# EAGLE design owl digital (EAGLE 6.4)
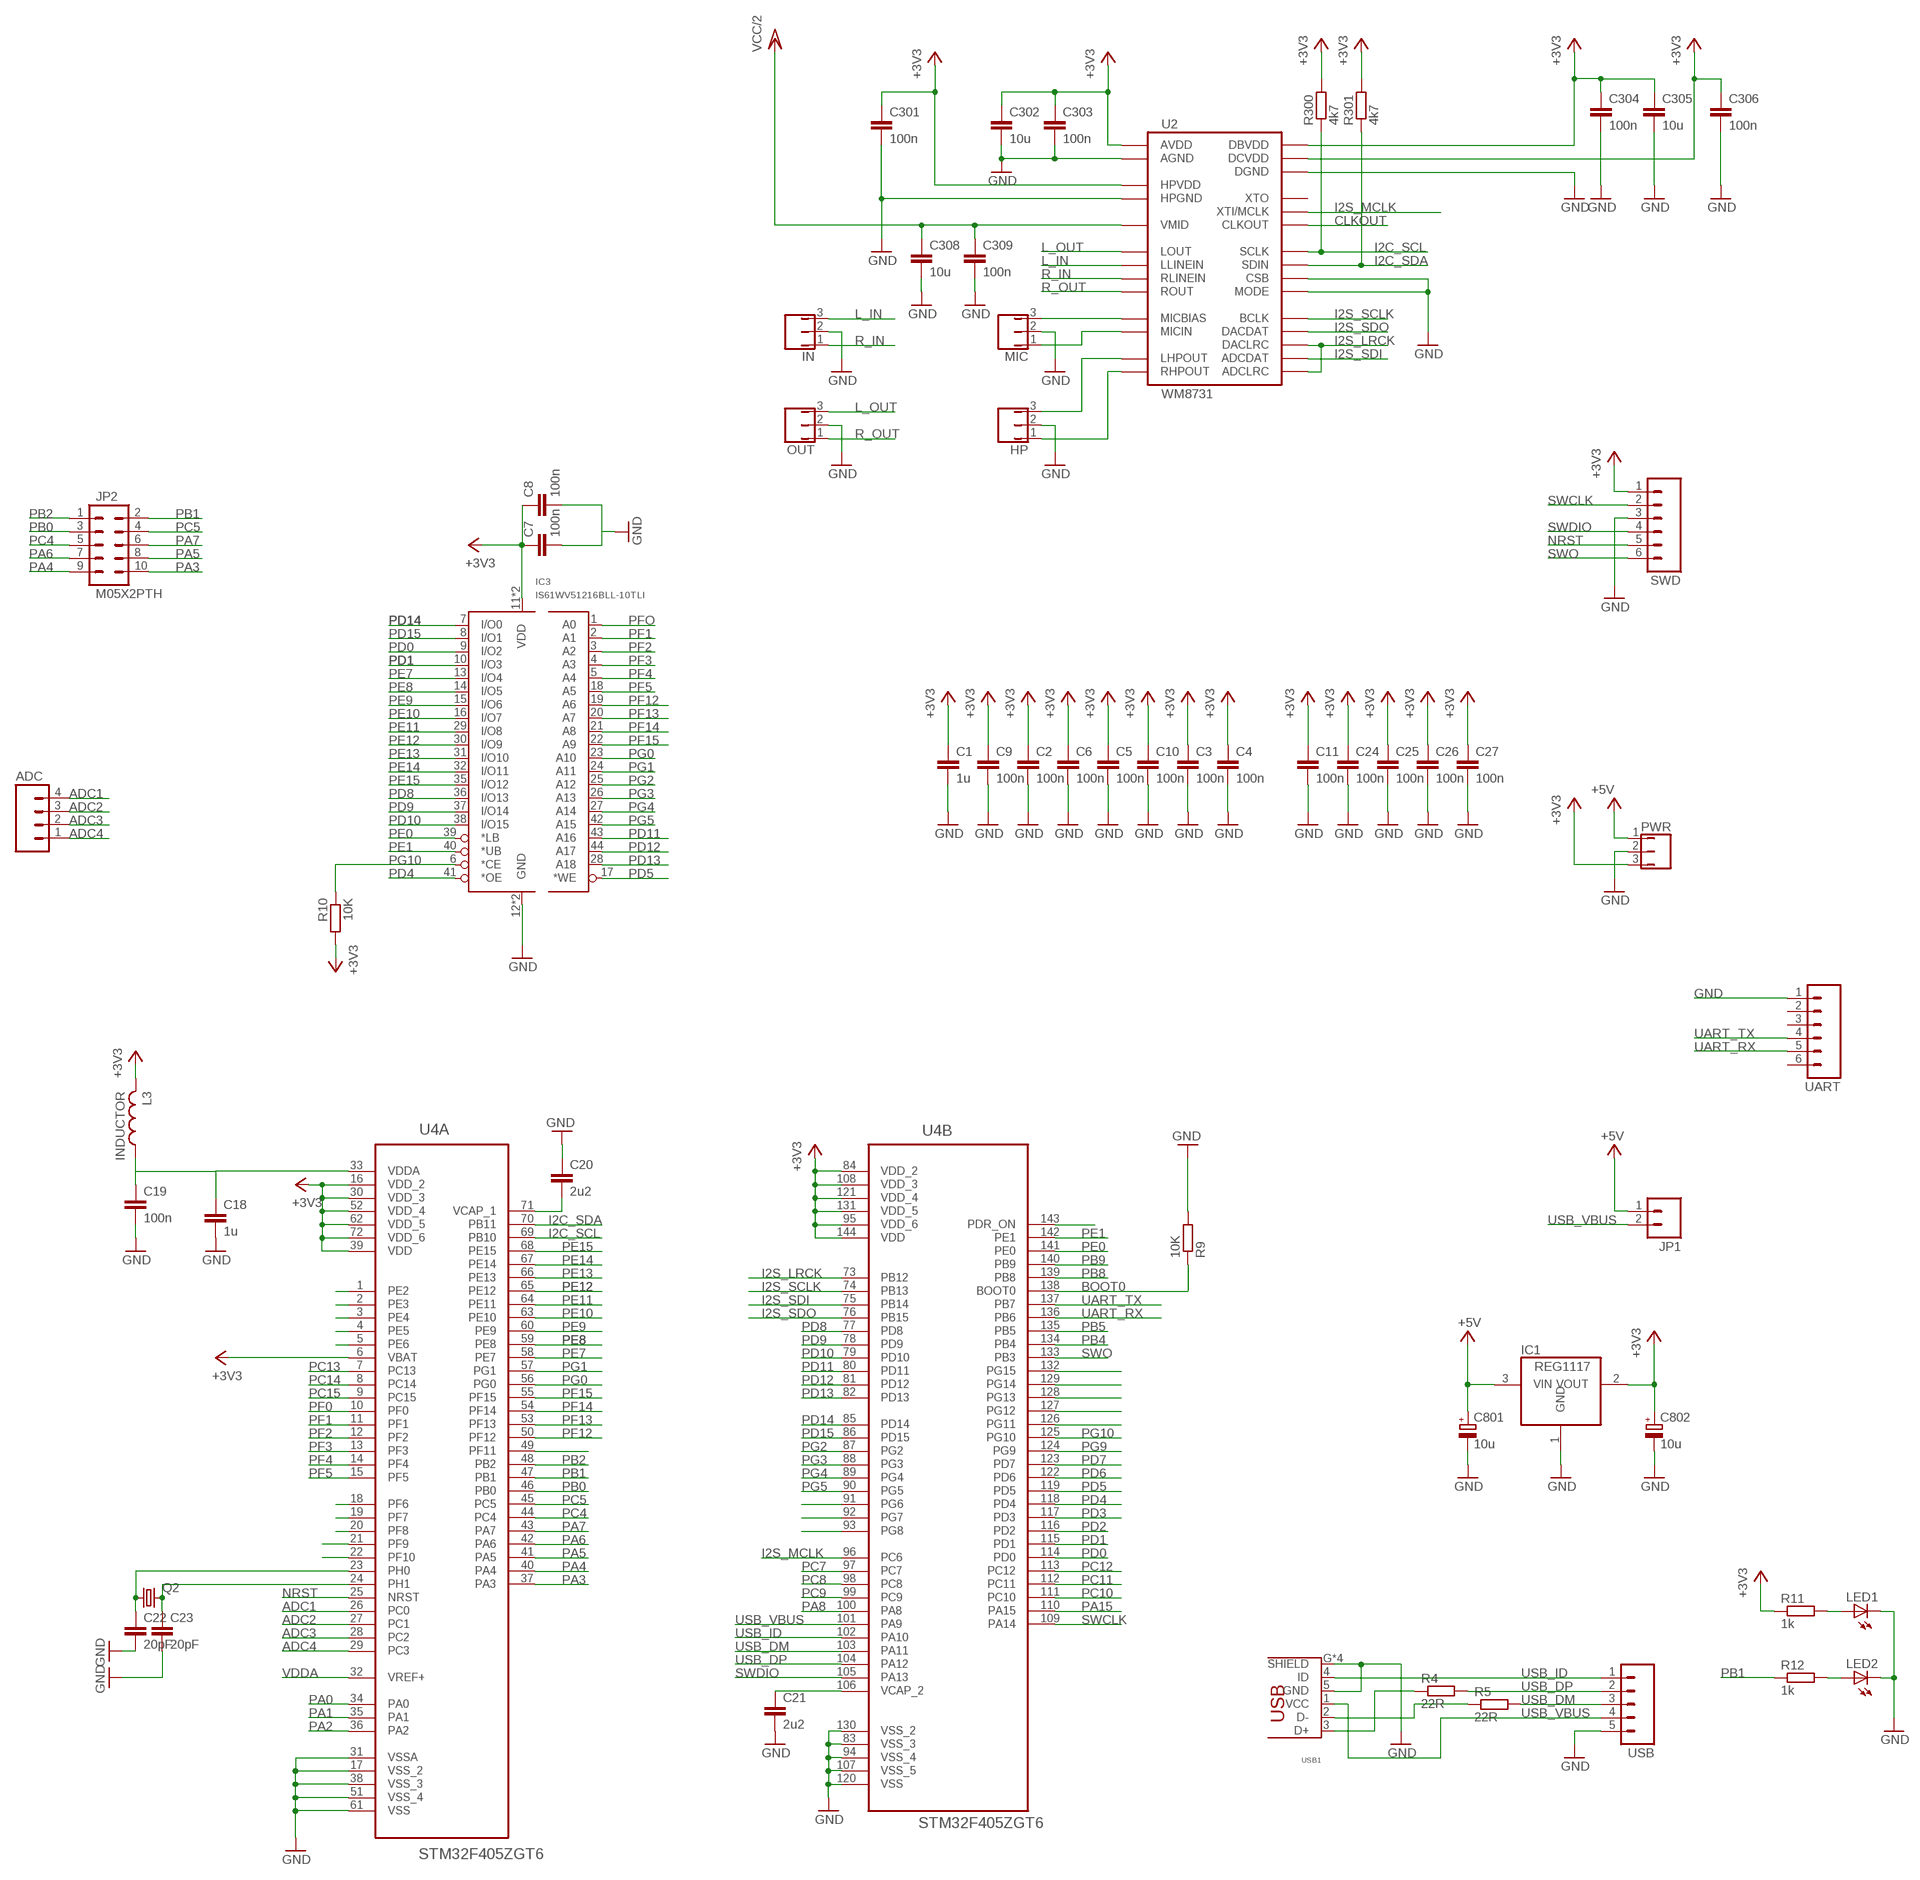
[diagram p0: schematic, sheet 1]

## Parts
ADC  M04PTH  [1X04]
C1  1u  C-EUC0603  [C0603]
C2  100n  C-EUC0603  [C0603]
C3  100n  C-EUC0603  [C0603]
C4  100n  C-EUC0603  [C0603]
C5  100n  C-EUC0603  [C0603]
C6  100n  C-EUC0603  [C0603]
C7  100n  C-EUC0603  [C0603]
C8  100n  C-EUC0603  [C0603]
C9  100n  C-EUC0603  [C0603]
C10  100n  C-EUC0603  [C0603]
C11  100n  C-EUC0603  [C0603]
C18  1u  C-EUC0603  [C0603]
C19  100n  C-EUC0603  [C0603]
C20  2u2  C-EUC0603  [C0603]
C21  2u2  C-EUC0603  [C0603]
C22  20pF  C-EUC0603  [C0603]
C23  20pF  C-EUC0603  [C0603]
C24  100n  C-EUC0603  [C0603]
C25  100n  C-EUC0603  [C0603]
C26  100n  C-EUC0603  [C0603]
C27  100n  C-EUC0603  [C0603]
C301  100n  C-EUC0603  [C0603]
C302  10u  C-EUC1206  [C1206]
C303  100n  C-EUC0603  [C0603]
C304  100n  C-EUC0603  [C0603]
C305  10u  C-EUC1206  [C1206]
C306  100n  C-EUC0603  [C0603]
C308  10u  C-EUC1206  [C1206]
C309  100n  C-EUC0603  [C0603]
C801  10u  CPOL-EUA  [PANASONIC_A]
C802  10u  CPOL-EUA  [PANASONIC_A]
HP  JMP/3P/SIP  [JMP/3P/SIP]
IC1  REG1117  [SOT223]
IC3  IS61WV51216BLL-10TLI  [TSOP44-II]
IN  JMP/3P/SIP  [JMP/3P/SIP]
JP1  M02PTH  [1X02]
JP2  M05X2PTH  [AVR_ICSP]
L3  INDUCTOR  [0603]
LED1  LED1206  [LED-1206]
LED2  LED1206  [LED-1206]
MIC  JMP/3P/SIP  [JMP/3P/SIP]
OUT  JMP/3P/SIP  [JMP/3P/SIP]
PWR  JMP/3P/SIP  [JMP/3P/SIP]
Q2  CRYSTALHC49UP  [HC49UP]
R4  22R  R-EU_R0603  [R0603]
R5  22R  R-EU_R0603  [R0603]
R9  10K  R-EU_R0603  [R0603]
R10  10K  R-EU_R0603  [R0603]
R11  1k  R-EU_R0603  [R0603]
R12  1k  R-EU_R0603  [R0603]
R300  4k7  R-EU_R0603  [R0603]
R301  4k7  R-EU_R0603  [R0603]
SWD  M06SIP  [1X06]
U2  WM8731  [28-SSOP]
U4  STM32F405ZGT6  [QFP50P2200X2200X160-144N]
UART  M06SIP  [1X06]
USB  M05PTH  [1X05]
USB1  USB_HRS_ZX62-B-5PA(11)MICRO.B-  [HRS_ZX62D-AB-5P8_USB]

## Nets
+3V3: C1.1 C2.1 C3.1 C4.1 C5.1 C6.1 C7.1 C8.1 C9.1 C10.1 C11.1 C24.1 C25.1 C26.1 C27.1 C301.1 C302.1 C303.1 C304.1 C305.1 C306.1 C802.+ IC1.2(VOUT) IC3.11(VDD) IC3.33(VDD) L3.2 PWR.3 R10.2 R11.1 R300.2 R301.2 SWD.1 U2.P$1(DBVDD) U2.P$8(HPVDD) U2.P$14(AVDD) U2.P$27(DCVDD) U4.6(A:VBAT) U4.16(A:VDD_2) U4.30(A:VDD_3) U4.39(A:VDD) U4.52(A:VDD_4) U4.62(A:VDD_5) U4.72(A:VDD_6) U4.84(B:VDD_2) U4.95(B:VDD_6) U4.108(B:VDD_3) U4.121(B:VDD_4) U4.131(B:VDD_5) U4.144(B:VDD)
+5V: C801.+ IC1.3(VIN) JP1.1 PWR.1
ADC1: ADC.4 U4.26(A:PC0)
ADC2: ADC.3 U4.27(A:PC1)
ADC3: ADC.2 U4.28(A:PC2)
ADC4: ADC.1 U4.29(A:PC3)
BOOT0: R9.1 U4.138(B:BOOT0)
CLKOUT: U2.P$2(CLKOUT)
GND: C1.2 C2.2 C3.2 C4.2 C5.2 C6.2 C7.2 C8.2 C9.2 C10.2 C11.2 C18.2 C19.2 C20.1 C21.2 C22.2 C23.2 C24.2 C25.2 C26.2 C27.2 C301.2 C302.2 C303.2 C304.2 C305.2 C306.2 C308.2 C309.2 C801.- C802.- HP.2 IC1.1(GND) IC3.12(GND) IC3.34(GND) IN.2 LED1.C LED2.C MIC.2 OUT.2 PWR.2 R9.2 SWD.3 U2.P$11(HPGND) U2.P$15(AGND) U2.P$21(MODE) U2.P$22(CSB) U2.P$28(DGND) U4.17(A:VSS_2) U4.31(A:VSSA) U4.38(A:VSS_3) U4.51(A:VSS_4) U4.61(A:VSS) U4.83(B:VSS_3) U4.94(B:VSS_4) U4.107(B:VSS_5) U4.120(B:VSS) U4.130(B:VSS_2) UART.1 USB1.5(GND) USB1.G2(SHIELD) USB1.G3(SHIELD) USB1.G4(SHIELD) USB1.G(SHIELD) USB.5
I2C_SCL: R300.1 U2.P$24(SCLK) U4.69(A:PB10)
I2C_SDA: R301.1 U2.P$23(SDIN) U4.70(A:PB11)
I2S_LRCK: U2.P$5(DACLRC) U2.P$7(ADCLRC) U4.73(B:PB12)
I2S_MCLK: U2.P$25(XTI/MCLK) U4.96(B:PC6)
I2S_SCLK: U2.P$3(BCLK) U4.74(B:PB13)
I2S_SDI: U2.P$6(ADCDAT) U4.75(B:PB14)
I2S_SDO: U2.P$4(DACDAT) U4.76(B:PB15)
L_IN: IN.3 U2.P$20(LLINEIN)
L_OUT: OUT.3 U2.P$12(LOUT)
N$1: MIC.3 U2.P$17(MICBIAS)
N$6: U4.49(A:PF11)
N$8: HP.3 U2.P$9(LHPOUT)
N$10: LED1.A R11.2
N$11: LED2.A R12.2
N$14: U4.21(A:PF9)
N$15: U4.22(A:PF10)
N$17: R4.1 USB1.3(D+)
N$21: R5.1 USB1.2(D-)
N$23: C23.1 Q2.2 U4.24(A:PH1)
N$24: C22.1 Q2.1 U4.23(A:PH0)
N$43: MIC.1 U2.P$18(MICIN)
N$44: HP.1 U2.P$10(RHPOUT)
N$54: U4.91(B:PG6)
N$75: U4.128(B:PG13)
N$76: U4.129(B:PG14)
N$77: U4.132(B:PG15)
N$106: U4.126(B:PG11)
N$107: U4.127(B:PG12)
N$113: U4.143(B:PDR_ON)
N$123: U4.19(A:PF7)
N$124: U4.18(A:PF6)
N$136: U4.5(A:PE6)
N$137: U4.4(A:PE5)
N$138: U4.3(A:PE4)
N$139: U4.2(A:PE3)
N$140: U4.1(A:PE2)
N$142: U4.93(B:PG8)
N$143: U4.92(B:PG7)
NRST: SWD.5 U4.25(A:NRST)
PA0: U4.34(A:PA0)
PA1: U4.35(A:PA1)
PA2: U4.36(A:PA2)
PA3: JP2.10 U4.37(A:PA3)
PA4: JP2.9 U4.40(A:PA4)
PA5: JP2.8 U4.41(A:PA5)
PA6: JP2.7 U4.42(A:PA6)
PA7: JP2.6 U4.43(A:PA7)
PA8: U4.100(B:PA8)
PA15: U4.110(B:PA15)
PB0: JP2.3 U4.46(A:PB0)
PB1: JP2.2 R12.1 U4.47(A:PB1)
PB2: JP2.1 U4.48(A:PB2)
PB4: U4.134(B:PB4)
PB5: U4.135(B:PB5)
PB8: U4.139(B:PB8)
PB9: U4.140(B:PB9)
PC4: JP2.5 U4.44(A:PC4)
PC5: JP2.4 U4.45(A:PC5)
PC7: U4.97(B:PC7)
PC8: U4.98(B:PC8)
PC9: U4.99(B:PC9)
PC10: U4.111(B:PC10)
PC11: U4.112(B:PC11)
PC12: U4.113(B:PC12)
PC13: U4.7(A:PC13)
PC14: U4.8(A:PC14)
PC15: U4.9(A:PC15)
PD0: IC3.9(I/O2) U4.114(B:PD0)
PD1: IC3.10(I/O3) U4.115(B:PD1)
PD2: U4.116(B:PD2)
PD3: U4.117(B:PD3)
PD4: IC3.41(*OE) U4.118(B:PD4)
PD5: IC3.17(*WE) U4.119(B:PD5)
PD6: U4.122(B:PD6)
PD7: U4.123(B:PD7)
PD8: IC3.36(I/O13) U4.77(B:PD8)
PD9: IC3.37(I/O14) U4.78(B:PD9)
PD10: IC3.38(I/O15) U4.79(B:PD10)
PD11: IC3.43(A16) U4.80(B:PD11)
PD12: IC3.44(A17) U4.81(B:PD12)
PD13: IC3.28(A18) U4.82(B:PD13)
PD14: IC3.7(I/O0) U4.85(B:PD14)
PD15: IC3.8(I/O1) U4.86(B:PD15)
PE0: IC3.39(*LB) U4.141(B:PE0)
PE1: IC3.40(*UB) U4.142(B:PE1)
PE7: IC3.13(I/O4) U4.58(A:PE7)
PE8: IC3.14(I/O5) U4.59(A:PE8)
PE9: IC3.15(I/O6) U4.60(A:PE9)
PE10: IC3.16(I/O7) U4.63(A:PE10)
PE11: IC3.29(I/O8) U4.64(A:PE11)
PE12: IC3.30(I/O9) U4.65(A:PE12)
PE13: IC3.31(I/O10) U4.66(A:PE13)
PE14: IC3.32(I/O11) U4.67(A:PE14)
PE15: IC3.35(I/O12) U4.68(A:PE15)
PF0: U4.10(A:PF0)
PF1: IC3.2(A1) U4.11(A:PF1)
PF2: IC3.3(A2) U4.12(A:PF2)
PF3: IC3.4(A3) U4.13(A:PF3)
PF4: IC3.5(A4) U4.14(A:PF4)
PF5: IC3.18(A5) U4.15(A:PF5)
PF9: U4.20(A:PF8)
PF12: IC3.19(A6) U4.50(A:PF12)
PF13: IC3.20(A7) U4.53(A:PF13)
PF14: IC3.21(A8) U4.54(A:PF14)
PF15: IC3.22(A9) U4.55(A:PF15)
PFO: IC3.1(A0)
PG0: IC3.23(A10) U4.56(A:PG0)
PG1: IC3.24(A11) U4.57(A:PG1)
PG2: IC3.25(A12) U4.87(B:PG2)
PG3: IC3.26(A13) U4.88(B:PG3)
PG4: IC3.27(A14) U4.89(B:PG4)
PG5: IC3.42(A15) U4.90(B:PG5)
PG9: U4.124(B:PG9)
PG10: IC3.6(*CE) R10.1 U4.125(B:PG10)
R_IN: IN.1 U2.P$19(RLINEIN)
R_OUT: OUT.1 U2.P$13(ROUT)
SWCLK: SWD.2 U4.109(B:PA14)
SWDIO: SWD.4 U4.105(B:PA13)
SWO: SWD.6 U4.133(B:PB3)
UART_RX: U4.136(B:PB6) UART.5
UART_TX: U4.137(B:PB7) UART.4
USB_DM: R5.2 U4.103(B:PA11) USB.3
USB_DP: R4.2 U4.104(B:PA12) USB.2
USB_ID: U4.102(B:PA10) USB1.4(ID) USB.1
USB_VBUS: JP1.2 U4.101(B:PA9) USB1.1(VCC) USB.4
VCAP1: C20.2 U4.71(A:VCAP_1)
VCAP2: C21.1 U4.106(B:VCAP_2)
VCC/2: C308.1 C309.1 U2.P$16(VMID)
VDDA: C18.1 C19.1 L3.1 U4.32(A:VREF+) U4.33(A:VDDA)
Unconnected: U2.P$26(XTO) UART.2 UART.3 UART.6

## Library data of the parts
ADC = SparkFun:M04: Header 4 Standard 4-pin 0.1" header. Use with straight break away headers (SKU : PRT-00116), right angle break away headers (PRT-00553), swiss pins (PRT-00743), machine pins (PRT-00117), and female headers (PRT-00115). Molex polarized connector foot print use with SKU : PRT-08231 with associated crimp pins and housings. 1MM SMD Version SKU: PRT-10208
C1-C11 C18-C27 C301-C306 C308 C309 = resistor:C-EU: CAPACITOR, European symbol
C801 C802 = resistor:CPOL-EU: POLARIZED CAPACITOR, European symbol
HP IN MIC OUT PWR = audioint:JMP/3P/SIP
IC1 = burr-brown:REG1117: 800mA and 1A Low Dropout (LDO) Positive Regulator 1.8V, 2.5V, 2.85V, 3.3V, 5V, and Adj; MPN: REG1117; OC_FARNELL: 1097566; OC_NEWARK: 14P6981
IC3 = Rebel:IS61WV51216BLL-10TLI: IS61WV51216BLL-10TLI - SRAM, 8MBIT, 10NS, 44TSOPII Manufacturer: INTEGRATED SILICON SOLUTION (ISSI) Farnell order code: 2253837 Manufacturer Part No: IS61WV51216BLL-10TLI Product Information SRAM, 8MBIT, 10NS, 44TSOPII Memory Size: 8Mbit Memory Configuration: 512K x 16bit Supply Voltage Min: 2.4V Supply Voltage Max: 3.6V Memory Case Style: TSOPII No. of Pins: 44 Access Time: 10ns Operating Temperature Min: -40°C Operating Temperature Max: 85°C MSL: MSL 3 - 168 hours SVHC: No SVHC (19-Dec-2012) Operating Temperature Range: -40°C to +85°C Supply Voltage Range: 2.4V to 3.6V
JP1 = SparkFun:M02: Header 2 Standard 2-pin 0.1" header. Use with straight break away headers (SKU : PRT-00116), right angle break away headers (PRT-00553), swiss pins (PRT-00743), machine pins (PRT-00117), and female headers (PRT-00115). Molex polarized connector foot print use with SKU : PRT-08233 with associated crimp pins and housings.
JP2 = SparkFun:M05X2: Header 5x2 Standard 10-pin dual row 0.1" header. Commonly used with AVR-ISP. Use with Spark Fun Electronics SKU: PRT-00778
L3 = Rebel:INDUCTOR
LED1 LED2 = SparkFun:LED: LEDs Standard schematic elements and footprints for 5mm, 3mm, 1206, and 0603 sized LEDs. 5mm - Spark Fun Electronics SKU : COM-00529 (and others)
Q2 = crystal:CRYSTAL: CRYSTAL; OC_FARNELL: unknown; OC_NEWARK: unknown
R4 R5 R9-R12 R300 R301 = resistor:R-EU_: RESISTOR, European symbol
SWD UART = SparkFun:M06: Header 6 Standard 6-pin 0.1" header. Use with straight break away headers (SKU : PRT-00116), right angle break away headers (PRT-00553), swiss pins (PRT-00743), machine pins (PRT-00117), and female headers (PRT-00115). Molex polarized connector foot print use with SKU : PRT-08094 with associated crimp pins and housings. NOTES ON THE VARIANTS LOCK and LOCK_LONGPADS... This footprint was designed to help hold the alignment of a through-hole component (i.e. 6-pin header) while soldering it into place. You may notice that each hole has been shifted either up or down by 0.005 of an inch from it's more standard position (which is a perfectly straight line). This slight alteration caused the pins (the squares in the middle) to touch the edges of the holes. Because they are alternating, it causes a "brace" to hold the component in place. 0.005 has proven to be the perfect amount of "off-center" position when using our standard breakaway headers. Although looks a little odd when you look at the bare footprint, once you have a header in there, the alteration is very hard to notice. Also, if you push a header all the way into place, it is covered up entirely on the bottom side. This idea of altering the position of holes to aid alignment will be further integrated into the Sparkfun Library for other footprints. It can help hold any component with 3 or more connection pins.
U2 = audioint:WM8731
U4 = Rebel:STM32F405ZGT6: IC, MCU, 32BIT, 1MB FLASH, 144LQFP; MPN: STM32F405ZGT6; OC_FARNELL: 2215225; OC_NEWARK: 46W2200; PACKAGE: 144LQFP; SUPPLIER: STMicroelectronics
USB = SparkFun:M05: Header 5 Standard 5-pin 0.1" header. Use with straight break away headers (SKU : PRT-00116), right angle break away headers (PRT-00553), swiss pins (PRT-00743), machine pins (PRT-00117), and female headers (PRT-00115). Molex polarized connector foot print use with SKU : PRT-08230 with associated crimp pins and housings.
USB1 = USB_connector:USB_HRS_ZX62-B-5PA(11)MICRO.B

## Board
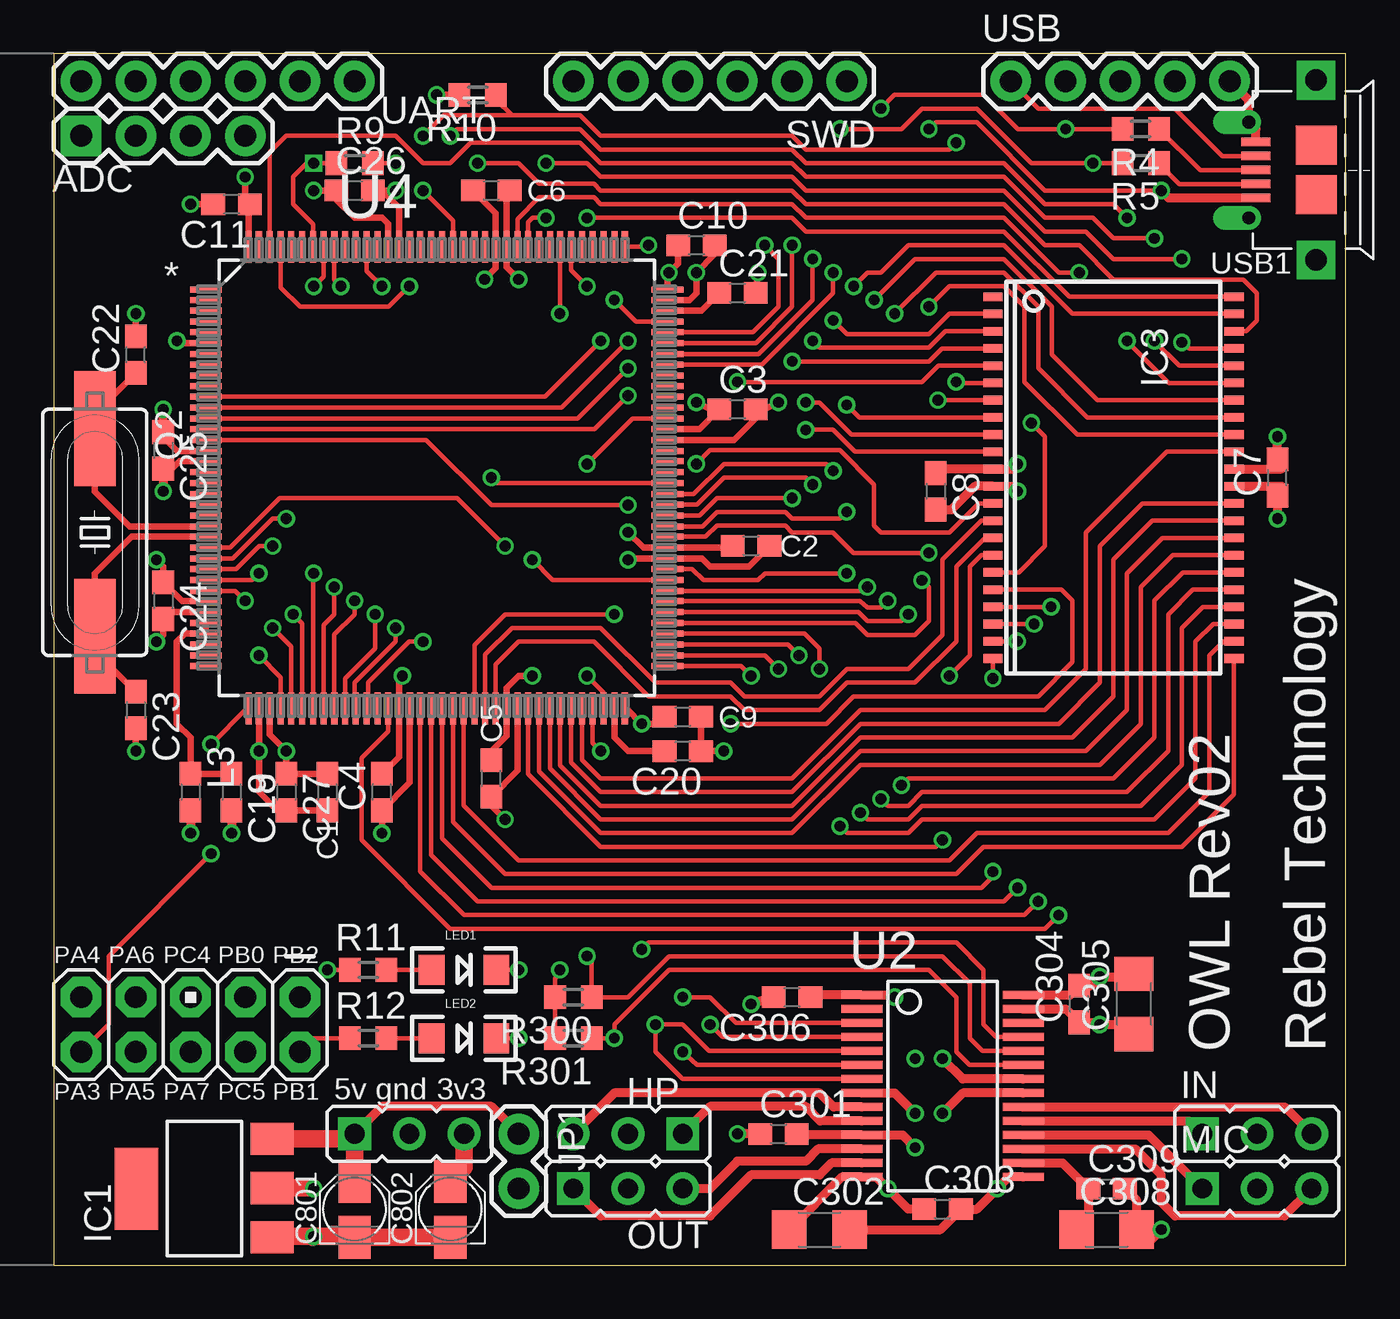
[diagram p1: board, top side]
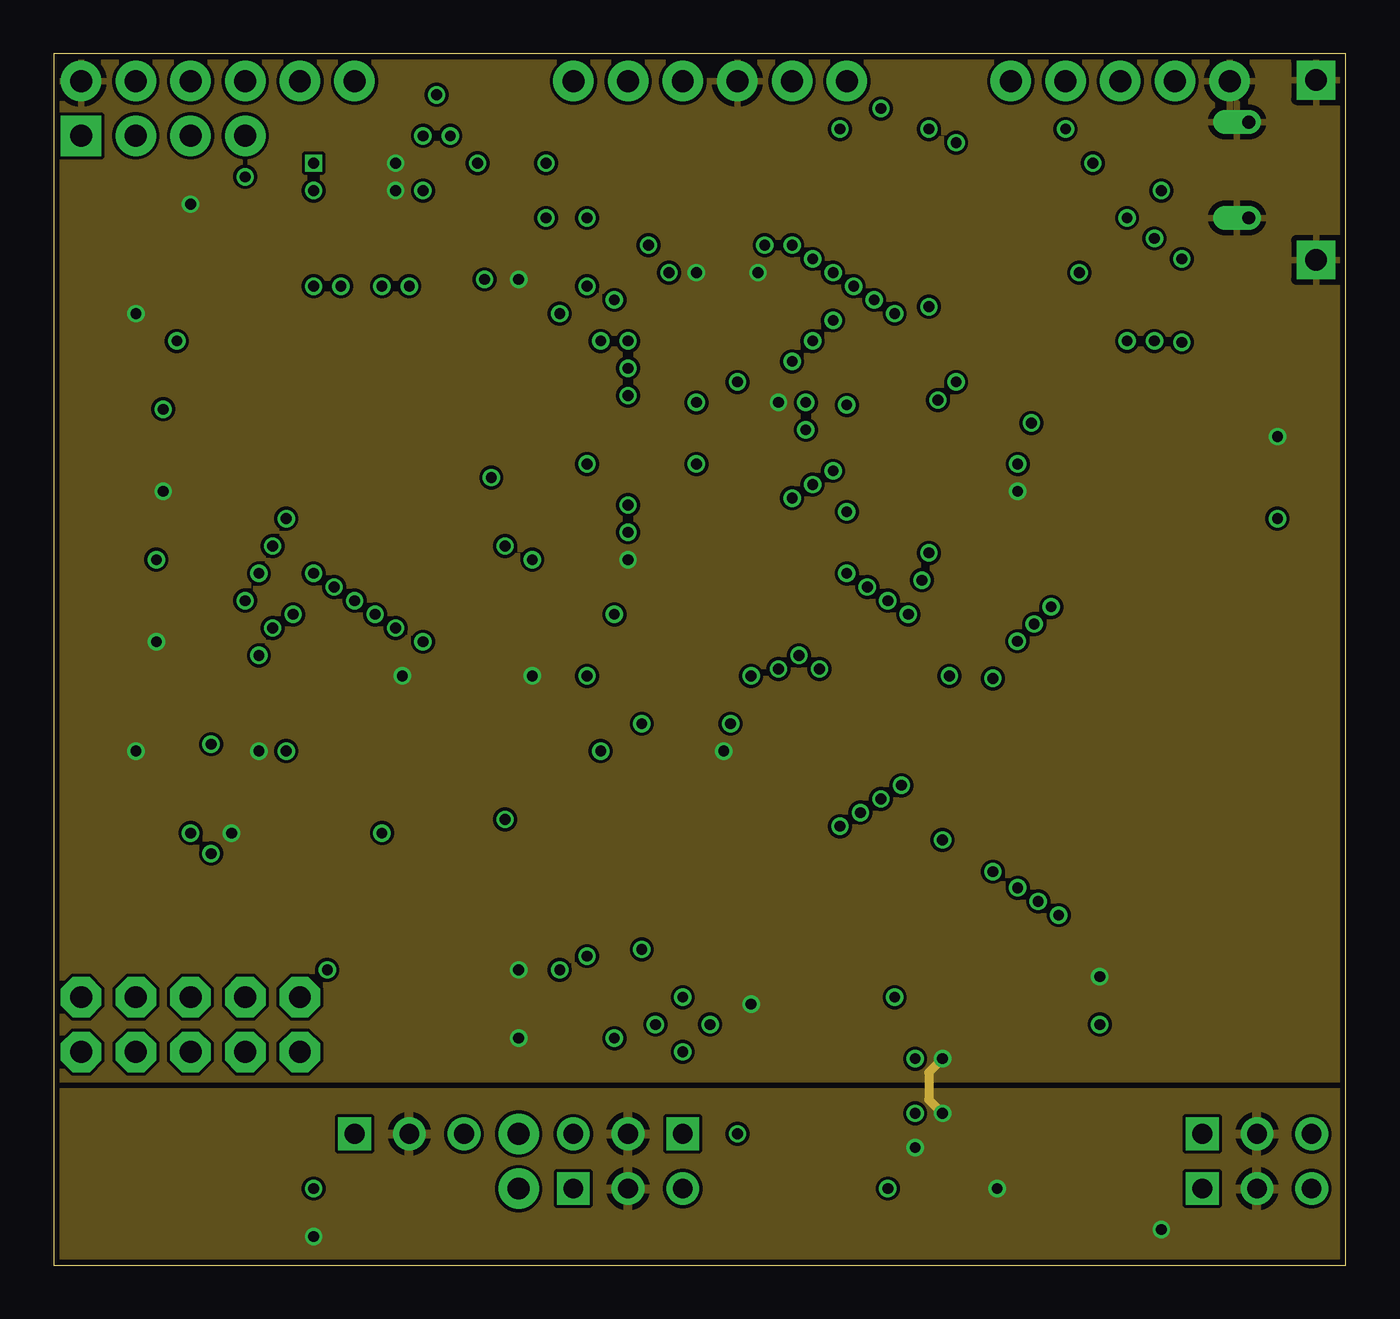
[diagram p2: board, inner layer Route2]
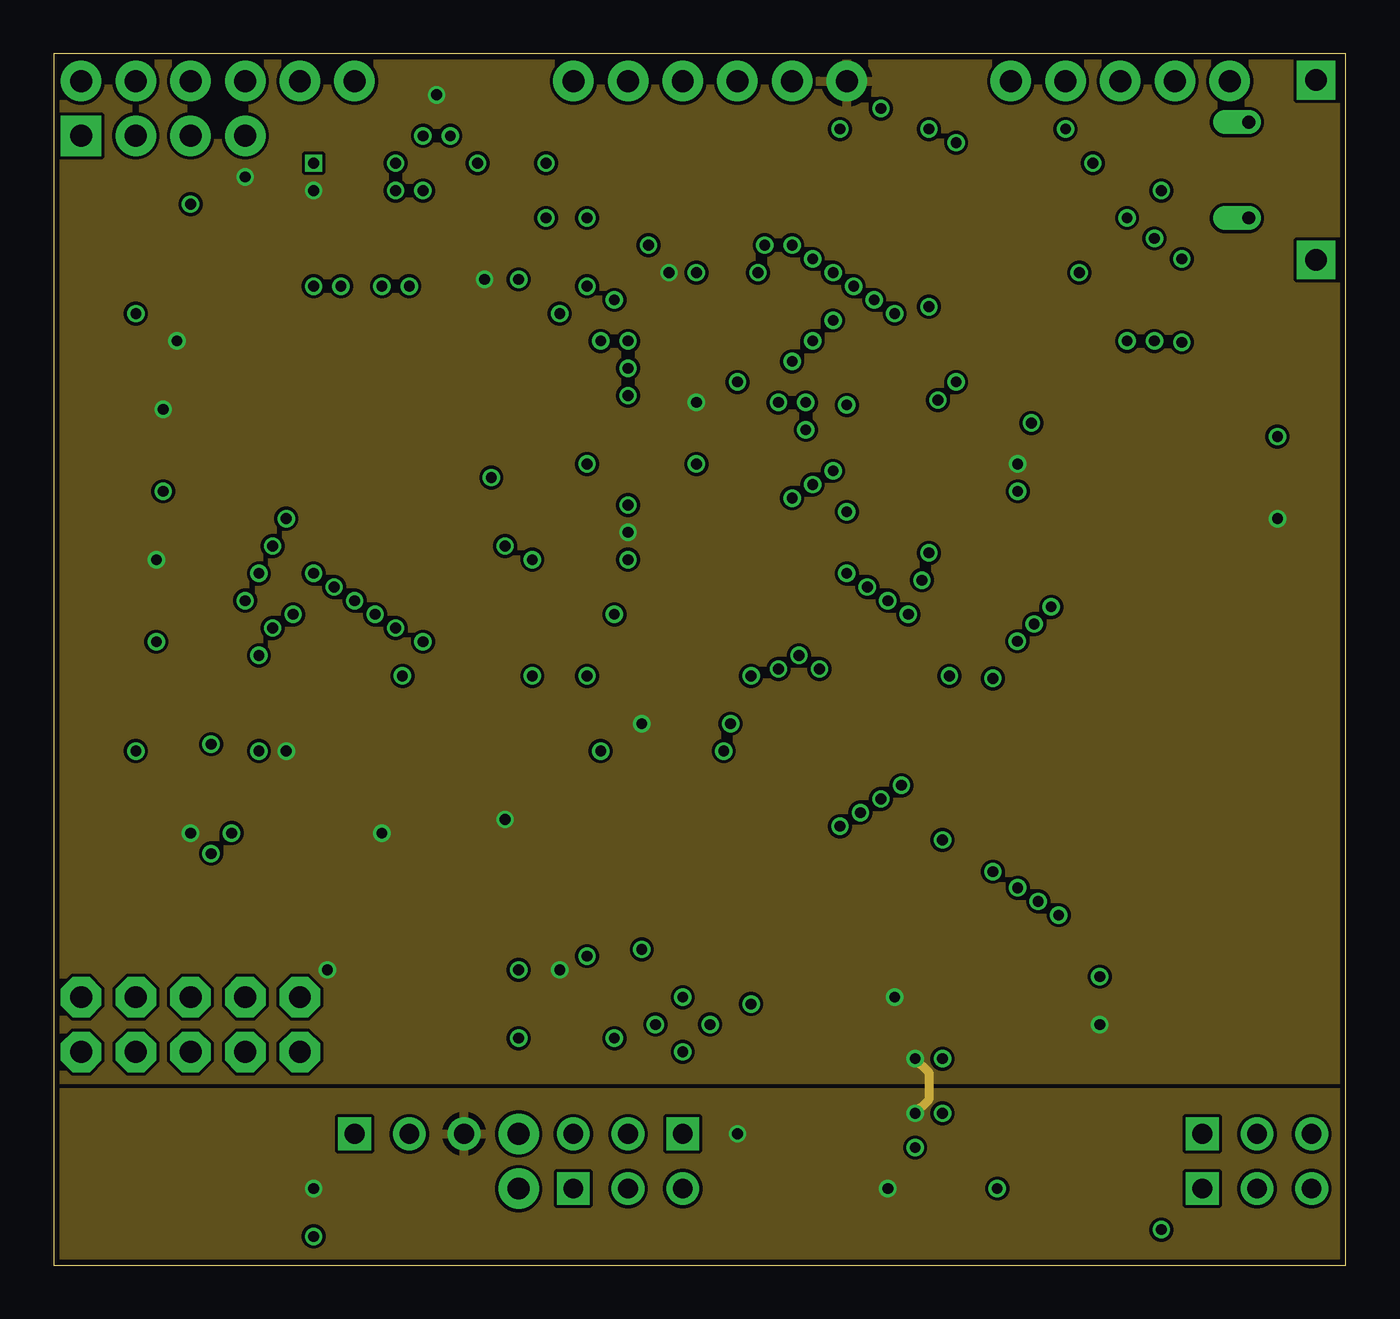
[diagram p3: board, inner layer Route15]
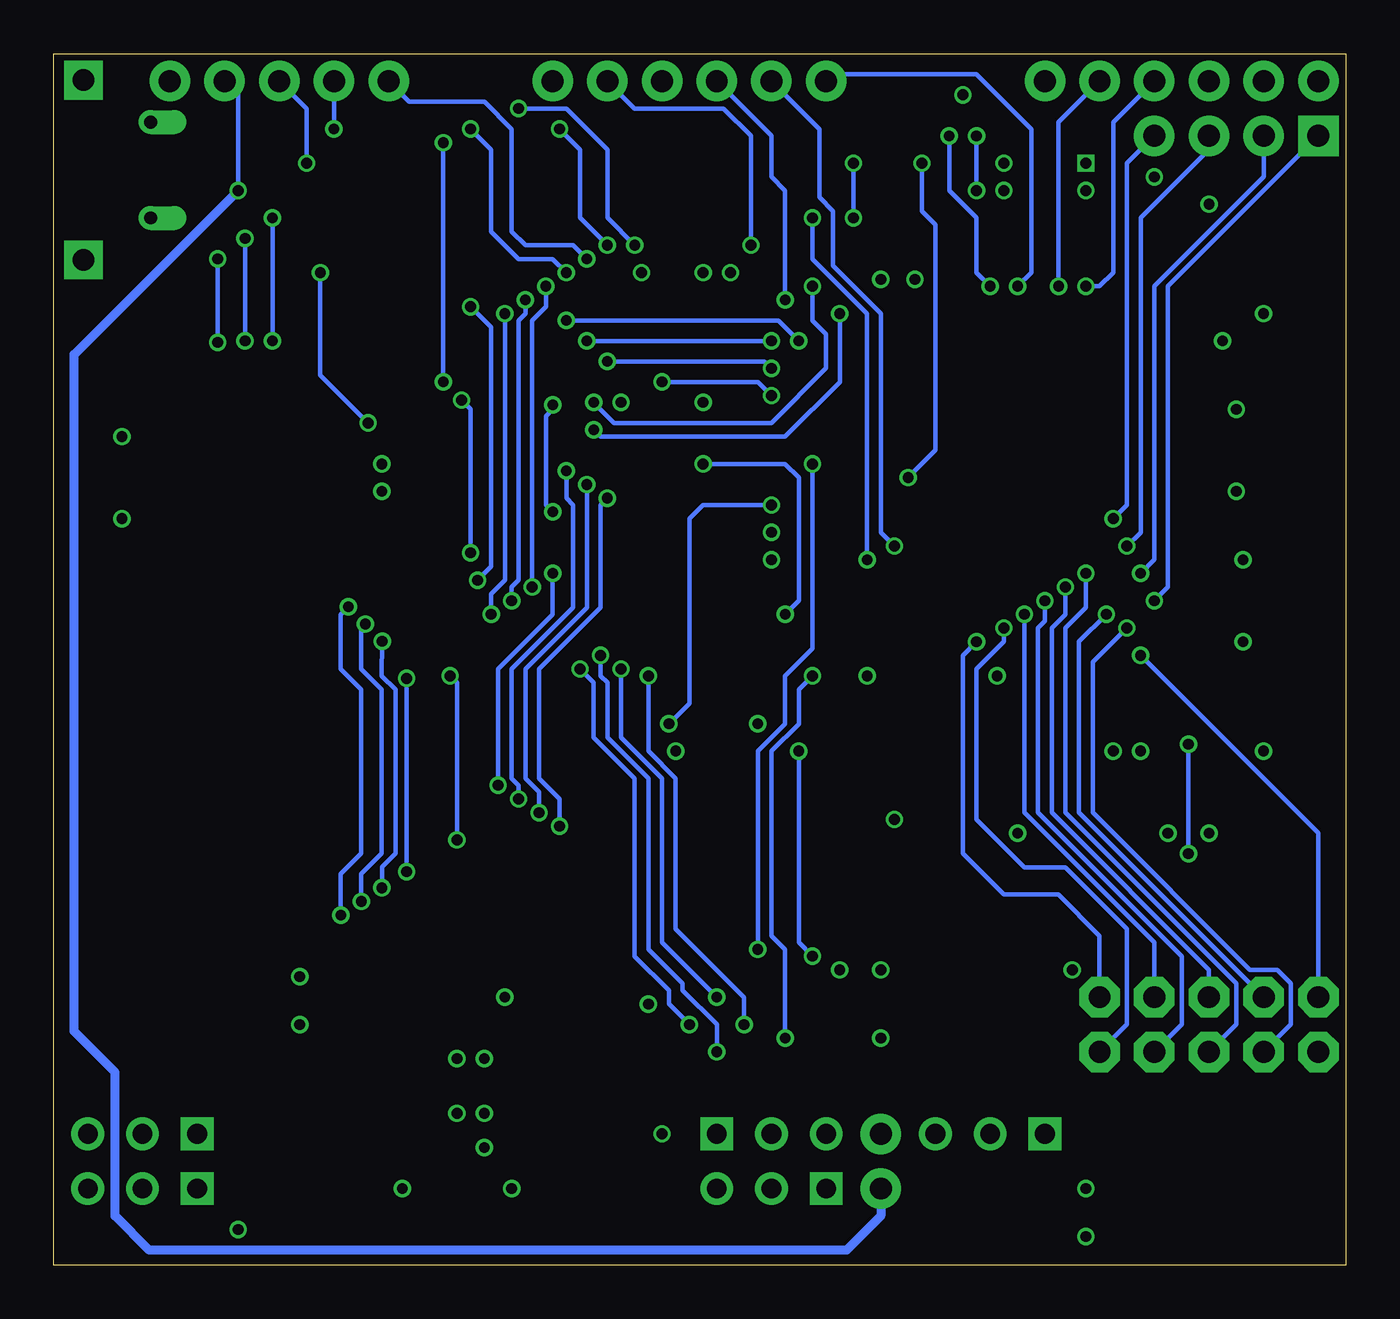
[diagram p4: board, bottom side, seen from below]

Size 60 x 56.26 mm. Coordinates in mm from the lower left corner, seen from the top.
Outline: 0,0 60,0 60,56.26 0,56.26 0,0
Copper layers (1*2+15*16): Top 0.035mm / dielectric 1.5mm / Route2 0.035mm / dielectric 0.15mm / Route15 0.035mm / dielectric 0.2mm / Bottom 0.035mm
Design rules "Rebel *": minimum track width 6mil, minimum drill 12mil, track to track 6mil, track to pad 6mil, pad to pad 6mil, via to via 6mil, smd to smd 0mil, copper to edge 10mil, drill to drill 10mil, minimum pad ring 10mil, minimum via ring 6mil, stop-mask expansion 2mil, vias tented up to drill 100mil, thermal gap 10mil

### Footprints (pad centres in the part's own frame; a part is rotated, then mirrored left to right if it is on the bottom)
1X04 = drill 1.016 pad 1.88 square: 1 0,0 | drill 1.016 pad 1.88: 2 2.54,0; 3 5.08,0; 4 7.62,0
C0603 = smd 1.1 x 1: 1 -0.85,0; 2 0.85,0
C1206 = smd 1.6 x 1.8: 1 -1.4,0; 2 1.4,0
PANASONIC_A = smd 2 x 1.5: + 1.3,0; - -1.3,0
JMP/3P/SIP = drill 0.914 pad 1.524 square: 1 -2.54,0 | drill 0.914 pad 1.524: 2 0,0; 3 2.54,0
SOT223 = smd 1.499 x 2.007: 1 -2.261,-3.15; 2 0.025,-3.15; 3 2.311,-3.15 | smd 3.81 x 2.007: 4 0,3.15
TSOP44-II = smd 0.4 x 0.9: 1 -8.4,-5.6; 2 -7.6,-5.6; 3 -6.8,-5.6; 4 -6,-5.6; 5 -5.2,-5.6; 6 -4.4,-5.6; 7 -3.6,-5.6; 8 -2.8,-5.6; 9 -2,-5.6; 10 -1.2,-5.6; 11 -0.4,-5.6; 12 0.4,-5.6; 13 1.2,-5.6; 14 2,-5.6; 15 2.8,-5.6; 16 3.6,-5.6; 17 4.4,-5.6; 18 5.2,-5.6; 19 6,-5.6; 20 6.8,-5.6; 21 7.6,-5.6; 22 8.4,-5.6; 23 8.4,5.6; 24 7.6,5.6; 25 6.8,5.6; 26 6,5.6; 27 5.2,5.6; 28 4.4,5.6; 29 3.6,5.6; 30 2.8,5.6; 31 2,5.6; 32 1.2,5.6; 33 0.4,5.6; 34 -0.4,5.6; 35 -1.2,5.6; 36 -2,5.6; 37 -2.8,5.6; 38 -3.6,5.6; 39 -4.4,5.6; 40 -5.2,5.6; 41 -6,5.6; 42 -6.8,5.6; 43 -7.6,5.6; 44 -8.4,5.6
1X02 = drill 1.016 pad 1.88: 1 0,0; 2 2.54,0
AVR_ICSP = drill 1.016 pad 1.88 octagon: 1 -1.27,5.08; 2 1.27,5.08; 3 -1.27,2.54; 4 1.27,2.54; 5 -1.27,0; 6 1.27,0; 7 -1.27,-2.54; 8 1.27,-2.54; 9 -1.27,-5.08; 10 1.27,-5.08
0603 = smd 1.1 x 1: 1 -0.85,0; 2 0.85,0
LED-1206 = smd 1.2 x 1.4: A -1.5,0; C 1.5,0
HC49UP = smd 5.334 x 1.93: 1 -4.826,0; 2 4.826,0
R0603 = smd 1 x 1.1: 1 -0.85,0; 2 0.85,0
1X06 = drill 1.016 pad 1.88: 1 0,0; 2 2.54,0; 3 5.08,0; 4 7.62,0; 5 10.16,0; 6 12.7,0
28-SSOP = smd 0.381 x 1.905: P$1 -4.55,-3.752; P$2 -3.9,-3.752; P$3 -3.25,-3.752; P$4 -2.6,-3.752; P$5 -1.95,-3.752; P$6 -1.3,-3.752; P$7 -0.65,-3.752; P$8 0,-3.752; P$9 0.65,-3.752; P$10 1.3,-3.752; P$11 1.95,-3.752; P$12 2.6,-3.752; P$13 3.25,-3.752; P$14 3.9,-3.752; P$15 3.9,3.752; P$16 3.25,3.752; P$17 2.6,3.752; P$18 1.95,3.752; P$19 1.3,3.752; P$20 0.65,3.752; P$21 0,3.752; P$22 -0.65,3.752; P$23 -1.3,3.752; P$24 -1.95,3.752; P$25 -2.6,3.752; P$26 -3.25,3.752; P$27 -3.9,3.752; P$28 -4.55,3.752
QFP50P2200X2200X160-144N = smd 1.473 x 0.279: 1 -10.719,8.738; 2 -10.719,8.255; 3 -10.719,7.747; 4 -10.719,7.239; 5 -10.719,6.756; 6 -10.719,6.248; 7 -10.719,5.74; 8 -10.719,5.258; 9 -10.719,4.75; 10 -10.719,4.242; 11 -10.719,3.759; 12 -10.719,3.251; 13 -10.719,2.743; 14 -10.719,2.261; 15 -10.719,1.753; 16 -10.719,1.245; 17 -10.719,0.762; 18 -10.719,0.254; 19 -10.719,-0.254; 20 -10.719,-0.762; 21 -10.719,-1.245; 22 -10.719,-1.753; 23 -10.719,-2.261; 24 -10.719,-2.743; 25 -10.719,-3.251; 26 -10.719,-3.759; 27 -10.719,-4.242; 28 -10.719,-4.75; 29 -10.719,-5.258; 30 -10.719,-5.74; 31 -10.719,-6.248; 32 -10.719,-6.756; 33 -10.719,-7.239; 34 -10.719,-7.747; 35 -10.719,-8.255; 36 -10.719,-8.738; 73 10.719,-8.738; 74 10.719,-8.255; 75 10.719,-7.747; 76 10.719,-7.239; 77 10.719,-6.756; 78 10.719,-6.248; 79 10.719,-5.74; 80 10.719,-5.258; 81 10.719,-4.75; 82 10.719,-4.242; 83 10.719,-3.759; 84 10.719,-3.251; 85 10.719,-2.743; 86 10.719,-2.261; 87 10.719,-1.753; 88 10.719,-1.245; 89 10.719,-0.762; 90 10.719,-0.254; 91 10.719,0.254; 92 10.719,0.762; 93 10.719,1.245; 94 10.719,1.753; 95 10.719,2.261; 96 10.719,2.743; 97 10.719,3.251; 98 10.719,3.759; 99 10.719,4.242; 100 10.719,4.75; 101 10.719,5.258; 102 10.719,5.74; 103 10.719,6.248; 104 10.719,6.756; 105 10.719,7.239; 106 10.719,7.747; 107 10.719,8.255; 108 10.719,8.738 | smd 0.279 x 1.473: 37 -8.738,-10.719; 38 -8.255,-10.719; 39 -7.747,-10.719; 40 -7.239,-10.719; 41 -6.756,-10.719; 42 -6.248,-10.719; 43 -5.74,-10.719; 44 -5.258,-10.719; 45 -4.75,-10.719; 46 -4.242,-10.719; 47 -3.759,-10.719; 48 -3.251,-10.719; 49 -2.743,-10.719; 50 -2.261,-10.719; 51 -1.753,-10.719; 52 -1.245,-10.719; 53 -0.762,-10.719; 54 -0.254,-10.719; 55 0.254,-10.719; 56 0.762,-10.719; 57 1.245,-10.719; 58 1.753,-10.719; 59 2.261,-10.719; 60 2.743,-10.719; 61 3.251,-10.719; 62 3.759,-10.719; 63 4.242,-10.719; 64 4.75,-10.719; 65 5.258,-10.719; 66 5.74,-10.719; 67 6.248,-10.719; 68 6.756,-10.719; 69 7.239,-10.719; 70 7.747,-10.719; 71 8.255,-10.719; 72 8.738,-10.719; 109 8.738,10.719; 110 8.255,10.719; 111 7.747,10.719; 112 7.239,10.719; 113 6.756,10.719; 114 6.248,10.719; 115 5.74,10.719; 116 5.258,10.719; 117 4.75,10.719; 118 4.242,10.719; 119 3.759,10.719; 120 3.251,10.719; 121 2.743,10.719; 122 2.261,10.719; 123 1.753,10.719; 124 1.245,10.719; 125 0.762,10.719; 126 0.254,10.719; 127 -0.254,10.719; 128 -0.762,10.719; 129 -1.245,10.719; 130 -1.753,10.719; 131 -2.261,10.719; 132 -2.743,10.719; 133 -3.251,10.719; 134 -3.759,10.719; 135 -4.242,10.719; 136 -4.75,10.719; 137 -5.258,10.719; 138 -5.74,10.719; 139 -6.248,10.719; 140 -6.756,10.719; 141 -7.239,10.719; 142 -7.747,10.719; 143 -8.255,10.719; 144 -8.738,10.719
1X05 = drill 1.016 pad 1.88: 1 0,0; 2 2.54,0; 3 5.08,0; 4 7.62,0; 5 10.16,0
HRS_ZX62D-AB-5P8_USB = smd 0.4 x 1.35: 1 -1.3,2.91; 2 -0.65,2.91; 3 0,2.91; 4 0.65,2.91; 5 1.3,2.91 | smd 1.8 x 1.9: D_0 -1.15,0.11; D_1 1.15,0.11 | drill 1 pad 1.8 square: G -4.175,0.11; G2 4.175,0.11 | drill 0.6 pad 0.813 offset: G3 -2.225,3.235; G4 2.225,3.235

### Placement (x,y rotation side)
ADC  1.27,52.45 0 top
C1  12.7,21.97 270 top
C2  32.38,33.4 0 top
C3  31.75,39.75 0 top
C4  15.24,21.97 90 top
C5  20.32,22.61 90 top
C6  20.32,49.91 0 top
C7  56.83,36.58 90 top
C8  40.96,35.94 270 top
C9  29.21,25.46 0 top
C10  29.84,47.37 0 top
C11  8.26,49.28 180 top
C18  8.26,21.97 270 top
C19  8.26,21.97 270 top
C20  29.21,23.88 180 top
C21  31.75,45.15 0 top
C22  3.81,42.29 90 top
C23  3.81,25.78 270 top
C24  5.08,30.86 270 top
C25  5.08,37.85 270 top
C26  13.97,49.91 0 top
C27  10.79,21.97 270 top
C301  33.66,6.1 0 top
C302  35.56,1.65 0 top
C303  41.27,2.6 0 top
C304  47.62,12.13 90 top
C305  50.16,12.13 90 top
C306  34.29,12.45 180 top
C308  48.9,1.65 0 top
C309  48.9,3.56 0 top
C801  13.97,2.6 90 top
C802  18.41,2.6 90 top
HP  26.67,6.1 180 top
IC1  6.99,3.56 90 top
IC3  49.21,36.58 270 top
IN  55.88,6.1 0 top
JP1  21.59,6.1 270 top
JP2  6.35,11.18 270 top
L3  6.35,21.97 270 top
LED1  19.05,13.72 0 top
LED2  19.05,10.54 0 top
MIC  55.88,3.56 0 top
OUT  26.67,3.56 0 top
PWR  16.51,6.1 0 top
Q2  1.91,34.04 270 top
R4  50.48,52.77 180 top
R5  50.48,51.18 180 top
R9  13.97,51.18 0 top
R10  19.68,54.36 180 top
R11  14.61,13.72 0 top
R12  14.61,10.54 0 top
R300  24.13,12.45 180 top
R301  24.13,10.54 180 top
SWD  36.83,54.99 180 top
U2  41.27,8 270 top
U4  17.78,36.58 0 top
UART  1.27,54.99 0 top
USB  44.45,54.99 0 top
USB1  58.74,50.86 90 top

### Tracks (layer width: path | path; a pad name or v marks a point on that pad's centre or on a via)
+3V3  (via drill 0.5, 0.5 pad 0.5)
  Top 0.203: U4.72 26.59,25.86 | 28.04,25.15 C9.1 | 31.29,33.33 C2.1 | C5.1 20.32,21.34 | C3.1 30.48,39.75 | C26.1 13.12,49.49 | 57.02,36.18 C7.1 | v23.5,13.72 23.28,13.3 R300.2 R301.2 | R11.1 v12.7,13.72
  Top 0.305: 26.59,25.86 v27.3,25.15 28.04,25.15 | 31.29,33.33 U4.84 27.38,33.33 v26.67,34.04 | U4.62 21.54,22.97 C5.1 | 20.32,21.34 v20.95,20.7 | U4.95 29.99,38.84 C3.1 | 30.48,39.75 v29.84,40.07 | U4.52 16.54,22.42 C4.1 v15.24,20.07 | 13.12,49.49 13.97,48.64 15.24,48.64 15.52,48.36 U4.131 | C26.1 v12.06,49.91 | U4.16 5.74,37.82 4.87,38.7 C25.1 | C1.1 C27.1 v10.79,23.88 10.03,24.64 U4.39 | v20,45.78 20.52,46.3 U4.121 20.52,48.86 C6.1 | U4.30 5.96,30.84 C24.1 5.08,32.45 v4.76,32.77 | U4.144 9.04,49.21 C11.1 8.89,49.28 v8.89,50.55 | R10.2 v17.78,54.36 | U4.108 28.5,46.03 v28.57,46.1 29,46.52 C10.1 | U4.6 5.82,42.82 v5.71,42.93
  Top 0.406: v44.77,37.21 44.53,36.98 IC3.11 41.14,36.98 C8.1 | L3.2 v6.35,20.07 | IC3.33 57.02,36.18 | C7.1 v56.83,34.67 | v40.01,7.05 39.05,8 U2.P$8 | v39.05,12.45 38.63,12.55 U2.P$1 35.24,12.55 C306.1 | C301.1 v31.75,6.1 | C25.1 v5.08,39.75 | U2.P$27 47,11.9 C304.1 48.48,11.28 v48.58,11.18 49.72,11.18 C305.1 | C302.1 36.61,4.1 U2.P$14 38.19,4.1 v38.73,3.56 39.69,2.6 C303.1
  Top 0.813: IC1.2 12.04,3.58 v12.06,3.56 | PWR.3 19.05,4.54 C802.+
  Route15 0.406: v40.01,9.59 40.64,8.95 40.64,7.68 v40.01,7.05
  pour Route15: -0.64,56.9 -0.64,8.64 60.33,8.64 60.33,56.9
  pour Route15: -0.64,8 -0.64,-0.89 60.33,-0.89 60.33,8
+5V
  Top 0.406: JP1.1 20.32,7.37 15.24,7.37 PWR.1
  Top 0.813: C801.+ PWR.1 13.74,5.87 IC1.3
ADC1  (via drill 0.5)
  Top 0.203: U4.26 8.31,32.82 10.16,34.67 v10.79,34.67
  Bottom 0.203: v10.79,34.67 10.16,35.31 10.16,51.18 ADC.4
ADC2  (via drill 0.5)
  Top 0.203: U4.27 8.46,32.33 9.53,33.4 v10.16,33.4
  Bottom 0.203: v10.16,33.4 9.53,34.04 9.53,48.64 6.35,51.82 ADC.3
ADC3  (via drill 0.5)
  Top 0.203: U4.28 9.22,31.83 v9.53,32.13
  Bottom 0.203: v9.53,32.13 8.89,32.77 8.89,45.47 3.81,50.55 ADC.2
ADC4  (via drill 0.5)
  Top 0.203: U4.29 8.43,31.32 v8.89,30.86
  Bottom 0.203: v8.89,30.86 8.26,31.5 8.26,45.47 ADC.1
BOOT0  (via drill 0.5)
  Top 0.203: U4.138 12.04,48.35 11.11,49.28 11.11,50.55 11.75,51.18 v12.06,51.18 R9.1
GND  (via drill 0.5, 0.5 pad 0.5)
  Top 0.203: 33.02,39.75 C3.2 32.6,39.33 | C26.2 15.24,49.91 | C27.2 10.38,21.12 | 20.32,23.88 C5.2 | 57.02,36.98 C7.2 | R9.2 v15.88,51.18 | LED2.C v21.59,10.54 | LED1.C v21.59,13.72
  Top 0.305: v31.11,23.88 C20.1 C9.2 | 20.32,23.88 21.03,24.59 U4.61 21.03,26.81 21.59,27.37 v22.23,27.37 | 33.02,39.75 v33.66,40.07 | C4.2 16.03,23.61 U4.51 16.03,27.2 v16.19,27.37 | 15.24,49.91 16.03,49.12 U4.130 | C25.2 5.5,37 | 5.5,37 5.84,37.34 U4.17 | U4.38 v9.53,23.88 9.53,21.97 10.38,21.12 | U4.94 31.6,38.33 32.6,39.33 | C27.2 C1.2 | 34.55,6.05 C301.2 | C26.2 v15.88,49.91 | 5.5,37 5.08,36.58 | C22.2 v3.81,44.2 | U4.31 5.4,30.33 C24.2 5.08,29.27 v4.76,28.96 | C23.2 v3.81,23.88 | 7.62,49.28 C11.2 v6.35,49.28 | C21.2 v32.7,46.1 | U4.107 29.53,44.83 29.84,45.15 v29.84,46.1 30.7,46.95 C10.2 | C2.2 32.28,32.45 30.48,32.45 30.11,32.82 U4.83 26.72,32.82 v26.67,32.77 | v21.59,45.78 21.03,46.34 U4.120 21.03,49.77 C6.2
  Top 0.406: v44.77,35.94 44.53,36.18 IC3.12 42.78,36.18 41.7,35.09 C8.2 | IC3.34 57.02,36.98 | C7.2 v56.83,38.48 | 34.55,6.05 U2.P$11 39.41,6.05 v40.01,5.46 | U2.P$21 42.23,8 v41.27,7.05 | U2.P$22 42.21,8.65 v41.27,9.59 | C309.2 50.3,3.01 C308.2 50.93,1.15 v51.44,1.65 | U2.P$15 44.36,4.1 v43.81,3.56 42.86,2.6 C303.2 41.17,1.65 C302.2 | 5.08,36.58 v5.08,35.94 | C19.2 v8.26,20.07 | C306.2 v32.38,12.13 | U2.P$28 47.2,12.55 C304.2 48.16,12.98 v48.58,13.4 50.03,13.4 C305.2 | USB1.5 55.83,52.76 USB1.G4 55.5,54.1 USB.5
  Top 0.813: C801.- C802.- | 13.66,1.29 C801.- | 12.03,1.29 v12.06,1.33 | v12.06,1.33 13.62,1.33 C801.- | v12.06,1.33 10.17,1.33 IC1.1
  Route2 0.406: v41.27,9.59 40.64,8.95 40.64,7.68 v41.27,7.05
  pour Route2: -0.64,8.64 -0.64,56.9 60.33,56.9 60.33,8.64
  pour Route2: -0.64,8 -0.64,-0.89 60.33,-0.89 60.33,8
I2C_SCL  (via drill 0.5)
  Top 0.203: U4.69 25.02,24.26 v25.4,23.88 | U2.P$24 43.13,9.95 42.55,10.54 42.55,13.08 41.27,14.35 28.57,14.35 26.67,12.45 25.4,12.45 | R300.1 24.98,14.14 v24.77,14.35
  Top 0.305: R300.1 25.4,12.45
  Bottom 0.203: v25.4,23.88 25.4,14.99 v24.77,14.35
I2C_SDA  (via drill 0.5)
  Top 0.203: U4.70 25.53,26.61 v24.77,27.37 | U2.P$23 42.52,9.3 41.91,9.91 41.91,12.45 40.64,13.72 28.57,13.72 26.04,11.18 v26.04,10.54 R301.1
  Bottom 0.203: v24.77,27.37 25.4,26.73 25.4,25.15 26.67,23.88 26.67,15.3 26.04,14.67 v26.04,10.54
I2S_LRCK  (via drill 0.5)
  Top 0.203: U4.73 31.91,27.84 v32.38,27.37 | U2.P$5 30.43,9.95 29.21,11.18 v27.94,11.18 27.94,9.91 29.2,8.65 U2.P$7
  Bottom 0.203: v27.94,11.18 27.94,12.45 31.11,15.62 31.11,22.61 32.38,23.88 v32.38,27.37
I2S_MCLK  (via drill 0.5)
  Top 0.203: U4.96 26.87,39.32 v24.77,37.21 | v27.3,14.67 27.62,14.99 41.91,14.99 43.18,13.72 43.18,11.18 43.76,10.6 U2.P$25
  Bottom 0.203: v24.77,37.21 24.77,28.64 26.04,27.37 26.04,25.15 27.3,23.88 v27.3,14.67
I2S_SCLK  (via drill 0.5)
  Top 0.203: U4.74 33.02,28.32 v33.66,27.69 | v29.21,12.45 30.48,12.45 31.68,11.25 U2.P$3
  Bottom 0.203: v29.21,12.45 31.75,14.99 31.75,22.61 33.66,24.51 v33.66,27.69
I2S_SDI  (via drill 0.5)
  Top 0.203: U2.P$6 29.88,9.3 v29.21,9.91 | U4.75 34.1,28.83 v34.61,28.32
  Bottom 0.203: v29.21,9.91 29.21,11.18 30.8,12.76 30.8,13.08 32.38,14.67 32.38,22.61 34.29,24.51 34.29,27.05 34.61,27.37 v34.61,28.32
I2S_SDO  (via drill 0.5)
  Top 0.203: U2.P$4 31.05,10.6 v30.48,11.18 | U4.76 34.86,29.34 35.56,28.64 v35.56,27.69
  Bottom 0.203: v30.48,11.18 31.43,12.13 31.43,12.76 33.02,14.35 33.02,22.61 34.92,24.51 34.92,27.05 v35.56,27.69
L_IN
  Top 0.406: U2.P$20 57.16,7.35 IN.3
L_OUT
  Top 0.406: U2.P$12 35.5,5.4 34.92,4.83 31.75,4.83 30.48,3.56 OUT.3
N$1
  Top 0.406: MIC.3 57.15,2.29 52.07,2.29 51.44,2.92 51.44,4.19 50.23,5.4 U2.P$17
N$8
  Top 0.406: U2.P$9 36.21,7.35 35.56,8 26.04,8 HP.3
N$10
  Top 0.203: R11.2 LED1.A
N$11
  Top 0.203: R12.2 LED2.A
N$17
  Top 0.203: R4.1 53.24,50.86 USB1.3
N$21
  Top 0.203: R5.1 52.27,50.21 USB1.2
N$23
  Top 0.305: C23.1 1.91,28.54 Q2.2 1.91,32.13 3.61,33.83 U4.24
N$24
  Top 0.305: U4.23 3.53,34.32 1.91,35.94 Q2.1 | Q2.1 1.91,38.48 | Q2.1 1.91,39.54 C22.1
N$43
  Top 0.406: U2.P$18 50.84,6.05 MIC.1
N$44
  Top 0.406: U2.P$10 35.59,6.7 34.92,7.37 30.48,7.37 HP.1
NRST  (via drill 0.5)
  Top 0.203: 20.88,33.33 v20.95,33.4 18.73,35.62 10.48,35.62 8.18,33.33 U4.25
  Bottom 0.203: v20.95,33.4 21.59,34.04 21.59,44.2 23.81,46.42 23.81,48.96 24.45,49.59 24.45,52.77 SWD.5
PA3  (via drill 0.5)
  Top 0.203: JP2.10 2.54,11.18 2.54,14.35 v7.3,19.11 | U4.37 8.97,25.86 v7.3,24.19
  Bottom 0.203: v7.3,19.11 v7.3,24.19
PA4  (via drill 0.5)
  Top 0.203: U4.40 10.54,27.3 v9.53,28.32
  Bottom 0.203: JP2.9 1.27,20.07 v9.53,28.32
PA5  (via drill 0.5)
  Top 0.203: U4.41 11.02,28.73 v10.16,29.59
  Bottom 0.203: JP2.8 2.54,11.18 2.54,13.08 3.17,13.72 4.45,13.72 11.75,21.02 11.75,28 v10.16,29.59
PA6  (via drill 0.5)
  Top 0.203: U4.42 11.53,29.81 v11.11,30.23
  Bottom 0.203: JP2.7 12.38,21.02 12.38,28.96 v11.11,30.23
PA7  (via drill 0.5)
  Top 0.203: U4.43 12.04,32.11 v12.06,32.13
  Bottom 0.203: JP2.6 5.08,11.18 5.08,13.08 13.02,21.02 13.02,29.59 12.06,30.54 v12.06,32.13
PB0  (via drill 0.5)
  Top 0.203: U4.46 13.54,27.25 14.92,28.64 v14.92,30.23
  Bottom 0.203: v14.92,30.23 14.92,21.02 8.89,14.99 JP2.3
PB1  (via drill 0.5)
  Top 0.203: U4.47 13.97,25.91 13.97,27.05 15.88,28.96 v15.88,29.59 | R12.1 12.06,10.54 JP2.2
  Bottom 0.203: v15.88,29.59 15.88,28.96 17.14,27.69 17.14,20.7 14.92,18.48 13.02,18.48 10.16,15.62 10.16,11.18 JP2.2
PB2  (via drill 0.5)
  Top 0.203: U4.48 14.61,25.93 14.61,27.05 16.51,28.96 v17.14,28.96
  Bottom 0.203: JP2.1 11.43,15.3 13.34,17.21 15.88,17.21 17.78,19.11 17.78,28.32 v17.14,28.96
PC4  (via drill 0.5)
  Top 0.203: U4.44 12.52,29.73 13.02,30.23 v13.02,31.5
  Bottom 0.203: JP2.5 6.35,13.72 13.65,21.02 13.65,29.59 13.02,30.23 v13.02,31.5
PC5  (via drill 0.5)
  Top 0.203: U4.45 13.03,29.29 13.97,30.23 v13.97,30.86
  Bottom 0.203: v13.97,30.86 13.97,29.91 14.29,29.59 14.29,21.02 7.62,14.35 7.62,11.18 JP2.4
PD0  (via drill 0.5)
  Top 0.203: IC3.9 37.05,38.58 35.56,40.07 v34.92,40.07 | U4.114 24.03,46.2 v24.77,45.47
  Bottom 0.203: v24.77,45.47 24.77,43.88 24.13,43.24 24.13,41.66 26.67,39.12 33.97,39.12 v34.92,40.07
PD1  (via drill 0.5)
  Top 0.203: IC3.10 37.22,37.78 36.2,38.8 v34.92,38.8 | U4.115 23.52,44.22 v23.5,44.2
  Bottom 0.203: v34.92,38.8 34.61,38.48 26.04,38.48 23.5,41.02 v23.5,44.2
PD4  (via drill 0.5)
  Top 0.203: v22.86,51.18 24.77,51.18 25.4,50.55 34.29,50.55 34.92,49.91 44.13,49.91 46.04,48.01 47.94,48.01 49.21,46.74 v52.39,46.74 | IC3.41 52.74,42.58 v52.39,42.86 | U4.118 22.02,48.44 22.23,48.64 v22.86,48.64
  Bottom 0.203: v52.39,46.74 v52.39,42.86 | v22.86,48.64 v22.86,51.18
PD5  (via drill 0.5)
  Top 0.203: IC3.17 44.81,32.18 46.04,33.4 46.04,38.48 v45.4,39.12 | U4.119 21.54,48.59 22.54,49.59 25.08,49.59 25.4,49.28 34.29,49.28 34.92,48.64 44.13,48.64 46.67,46.1 v47.62,46.1
  Bottom 0.203: v45.4,39.12 47.62,41.34 v47.62,46.1
PD8  (via drill 0.5)
  Top 0.203: IC3.36 47.53,38.58 45.09,41.02 45.09,44.51 44.13,45.47 41.59,45.47 v40.64,44.51 | U4.77 37.24,29.82 37.78,29.27 40.01,29.27 40.64,29.91 40.64,31.5 v40.32,31.81
  Bottom 0.203: v40.64,44.51 39.69,43.56 39.69,32.45 v40.32,31.81
PD9  (via drill 0.5)
  Top 0.203: IC3.37 48,39.38 45.72,41.66 45.72,44.51 44.13,46.1 40.96,46.1 v39.05,44.2 | U4.78 37.36,30.33 37.78,29.91 39.37,29.91 v39.69,30.23
  Bottom 0.203: v39.69,30.23 39.69,31.18 39.05,31.81 v39.05,44.2
PD10  (via drill 0.5)
  Top 0.203: IC3.38 48.47,40.18 46.35,42.29 46.35,44.51 44.13,46.74 40.01,46.74 v38.1,44.83 | U4.79 37.44,30.84 37.78,30.54 38.42,30.54 v38.73,30.86
  Bottom 0.203: v38.73,30.86 38.73,31.5 38.42,31.81 38.42,43.88 38.1,44.2 v38.1,44.83
PD11  (via drill 0.5)
  Top 0.203: U4.80 37.6,31.32 v37.78,31.5 | v37.15,45.47 37.78,46.1 38.42,46.1 39.69,47.37 44.13,47.37 47.31,44.2 54.79,44.2 IC3.43
  Bottom 0.203: v37.78,31.5 37.78,43.88 37.15,44.51 v37.15,45.47
PD12  (via drill 0.5)
  Top 0.203: U4.81 23.16,31.83 v22.23,32.77 | v24.77,48.64 34.29,48.64 34.92,48.01 44.13,48.01 47.16,44.98 IC3.44
  Bottom 0.203: v22.23,32.77 22.23,44.2 24.77,46.74 v24.77,48.64
PD13  (via drill 0.5)
  Top 0.203: IC3.28 52.43,32.18 51.12,30.86 51.12,24.51 49.21,22.61 39.69,22.61 v39.37,22.29 | U4.82 29.64,32.33 30.16,31.81 32.7,31.81 33.02,32.13 v36.83,32.13
  Bottom 0.203: v36.83,32.13 36.83,30.23 39.37,27.69 v39.37,22.29
PD14  (via drill 0.5)
  Top 0.203: U4.85 30.28,33.83 30.8,34.35 33.97,34.35 34.29,34.04 36.2,34.04 37.15,33.08 v40.64,33.08 | IC3.7 v41.06,40.18
  Bottom 0.203: v41.06,40.18 40.64,39.75 v40.64,33.08
PD15  (via drill 0.5, 0.5 pad 0.5)
  Top 0.203: IC3.8 37.41,39.38 v36.83,39.95 | U4.86 30.12,34.32 30.8,34.99 33.97,34.99 34.29,34.67 36.51,34.67 v36.83,34.99
  Bottom 0.203: v36.83,34.99 37.15,35.31 37.15,39.43 36.83,39.75 v36.83,39.95
PE0  (via drill 0.5)
  Top 0.203: IC3.39 51.8,40.98 v49.85,42.93 | v18.41,52.45 18.73,52.77 24.45,52.77 25.4,51.82 34.29,51.82 34.92,51.18 44.13,51.18 46.04,49.28 49.21,49.28 v49.85,48.64 | U4.141 10.54,45.4 11.43,44.51 15.56,44.51 v16.51,45.47
  Bottom 0.203: v49.85,42.93 v49.85,48.64 | v18.41,52.45 18.41,49.91 17.14,48.64 17.14,46.1 v16.51,45.47
PE1  (via drill 0.5)
  Top 0.203: U4.142 10.03,51.69 10.79,52.45 15.88,52.45 17.14,51.18 18.41,51.18 19.37,52.13 24.45,52.13 25.4,51.18 34.29,51.18 34.92,50.55 44.13,50.55 46.04,48.64 48.26,48.64 49.21,47.69 v51.12,47.69 | IC3.40 52.27,41.78 v51.12,42.93
  Bottom 0.203: v51.12,42.93 v51.12,47.69
PE7  (via drill 0.5)
  Top 0.203: U4.58 19.53,28.8 20.95,30.23 v26.04,30.23 | v29.84,37.21 30.48,37.85 36.51,37.85 38.1,36.26 38.1,34.35 38.42,34.04 41.59,34.04 42.93,35.38 IC3.13
  Bottom 0.203: v26.04,30.23 25.4,30.86 25.4,36.58 26.04,37.21 v29.84,37.21
PE8
  Top 0.203: IC3.14 43.09,34.58 41.27,32.77 41.27,29.27 39.69,27.69 36.83,27.69 35.56,26.42 32.07,26.42 31.43,27.05 27.94,27.05 25.4,29.59 21.27,29.59 20.04,28.36 U4.59
PE9
  Top 0.203: U4.60 20.52,27.89 21.59,28.96 25.08,28.96 27.62,26.42 31.43,26.42 32.07,25.78 35.56,25.78 36.83,27.05 40.01,27.05 41.91,28.96 41.91,32.45 43.24,33.78 IC3.15
PE10  (via drill 0.5)
  Top 0.203: v41.27,19.75 40.96,19.43 25.4,19.43 22.02,22.81 U4.63 | v41.59,27.37 42.55,28.32 42.55,32.45 43.07,32.98 IC3.16
  Bottom 0.203: v41.59,27.37 41.27,27.05 v41.27,19.75
PE11
  Top 0.203: IC3.29 51.96,32.98 50.48,31.5 50.48,25.15 48.58,23.24 37.47,23.24 34.29,20.07 25.4,20.07 22.53,22.94 U4.64
PE12
  Top 0.203: IC3.30 51.49,33.78 49.85,32.13 49.85,25.78 47.94,23.88 37.47,23.88 34.29,20.7 25.4,20.7 23.04,23.06 U4.65
PE13
  Top 0.203: IC3.31 51.02,34.58 49.21,32.77 49.21,26.42 47.31,24.51 37.47,24.51 34.29,21.34 25.4,21.34 23.52,23.22 U4.66
PE14
  Top 0.203: IC3.32 50.55,35.38 48.58,33.4 48.58,27.05 46.67,25.15 37.47,25.15 34.29,21.97 25.4,21.97 24.03,23.34 U4.67
PE15
  Top 0.203: IC3.35 51.68,37.78 47.94,34.04 47.94,27.69 46.04,25.78 37.47,25.78 34.29,22.61 25.4,22.61 24.54,23.47 U4.68
PF1  (via drill 0.5)
  Top 0.203: U4.11 22.81,40.34 v25.4,42.93 | IC3.2 43.59,44.2 41.59,44.2 40.64,43.24 36.83,43.24 v36.2,43.88
  Bottom 0.203: v36.2,43.88 26.35,43.88 v25.4,42.93
PF2  (via drill 0.5)
  Top 0.203: U4.12 23.57,39.83 v26.67,42.93 | IC3.3 41.41,43.38 40.64,42.61 35.56,42.61 v35.24,42.93
  Bottom 0.203: v26.67,42.93 v35.24,42.93
PF3  (via drill 0.5)
  Top 0.203: v34.29,41.97 40.64,41.97 41.24,42.58 IC3.4 | v26.67,41.66 24.33,39.32 U4.13
  Bottom 0.203: v26.67,41.66 26.99,41.97 v34.29,41.97
PF4  (via drill 0.5)
  Top 0.203: v26.67,40.39 25.12,38.84 U4.14 | IC3.5 41.08,41.78 40.32,41.02 v31.75,41.02
  Bottom 0.203: v26.67,40.39 27.3,41.02 v31.75,41.02
PF5  (via drill 0.5)
  Top 0.203: U4.15 17.3,38.33 20.32,35.31 v26.67,35.31 | v31.43,25.15 35.88,25.15 37.15,26.42 45.72,26.42 47.31,28 47.31,30.86 46.79,31.38 IC3.18
  Bottom 0.203: v31.43,25.15 30.48,26.1 30.48,34.67 29.84,35.31 v26.67,35.31
PF12  (via drill 0.5)
  Top 0.203: IC3.19 v46.32,30.58 | U4.50 15.52,24.79 14.29,23.56 14.29,19.75 18.41,15.62 46.04,15.62 v46.67,16.26
  Bottom 0.203: v46.32,30.58 46.67,30.23 46.67,27.69 45.72,26.73 45.72,19.11 46.67,18.16 v46.67,16.26
PF13  (via drill 0.5)
  Top 0.203: U4.53 17.02,18.29 19.05,16.26 45.09,16.26 v45.72,16.89 | IC3.20 v45.53,29.78
  Bottom 0.203: v45.53,29.78 45.72,29.59 45.72,27.69 44.77,26.73 44.77,19.11 45.72,18.16 v45.72,16.89
PF14  (via drill 0.5)
  Top 0.203: IC3.21 v44.75,28.98 | U4.54 17.53,19.05 19.68,16.89 44.13,16.89 v44.77,17.53
  Bottom 0.203: v44.75,28.98 44.77,27.37 44.13,26.73 44.13,19.11 44.75,18.5 44.75,17.55 v44.77,17.53
PF15  (via drill 0.5)
  Top 0.203: IC3.22 v43.61,27.25 | U4.55 18.03,19.81 20.32,17.53 43.09,17.53 43.61,18.05 v43.61,18.28
  Bottom 0.203: v43.61,27.25 v43.61,18.28
PG0
  Top 0.203: IC3.23 54.81,21.86 52.39,19.43 43.18,19.43 41.91,18.16 20.95,18.16 18.54,20.57 U4.56
PG1
  Top 0.203: IC3.24 54.31,28.98 53.66,28.32 53.66,21.97 51.75,20.07 42.86,20.07 41.59,18.8 21.59,18.8 19.02,21.36 U4.57
PG2  (via drill 0.5)
  Top 0.203: IC3.25 53.84,29.78 53.02,28.96 53.02,22.61 51.12,20.7 40.32,20.7 39.69,20.07 36.83,20.07 v36.51,20.38 | U4.87 30,34.82 30.8,35.62 v34.29,35.62
  Bottom 0.203: v34.29,35.62 34.61,35.31 34.61,30.54 37.47,27.69 37.47,22.61 36.51,21.65 v36.51,20.38
PG3  (via drill 0.5)
  Top 0.203: IC3.26 53.37,30.58 52.39,29.59 52.39,23.24 50.48,21.34 40.32,21.34 39.69,20.7 37.78,20.7 v37.47,21.02 | U4.88 29.87,35.33 31.11,36.58 34.92,36.58 v35.24,36.26
  Bottom 0.203: v37.47,21.02 37.47,21.97 38.1,22.61 38.1,27.69 35.24,30.54 v35.24,36.26
PG4  (via drill 0.5)
  Top 0.203: IC3.27 52.9,31.38 51.75,30.23 51.75,23.88 49.85,21.97 40.32,21.97 39.69,21.34 38.73,21.34 v38.42,21.65 | U4.89 29.72,35.81 31.11,37.21 35.88,37.21 v36.2,36.89
  Bottom 0.203: v38.42,21.65 38.42,22.29 38.73,22.61 38.73,27.69 35.88,30.54 35.88,35.31 36.2,35.62 v36.2,36.89
PG5  (via drill 0.5)
  Top 0.203: U4.90 20.57,36.32 v20.32,36.58 | v19.68,51.18 21.59,51.18 22.54,50.23 25.08,50.23 25.4,49.91 34.29,49.91 34.92,49.28 44.13,49.28 46.04,47.37 47.62,47.37 49.21,45.78 55.24,45.78 55.88,45.15 55.88,43.88 55.38,43.38 IC3.42
  Bottom 0.203: v20.32,36.58 19.05,37.85 19.05,48.32 19.68,48.96 v19.68,51.18
PG10  (via drill 0.5)
  Top 0.203: U4.125 18.54,48.51 v17.14,49.91 | v17.14,52.45 18.1,53.4 21.27,53.4 | 21.27,53.4 24.45,53.4 25.4,52.45 34.29,52.45 34.92,51.82 41.59,51.82 v41.91,52.13 | IC3.6 41.95,40.98 v41.91,41.02 | R10.1 20.54,54.14 21.27,53.4
  Bottom 0.203: v17.14,49.91 v17.14,52.45 | v41.91,52.13 v41.91,41.02
R_IN
  Top 0.406: U2.P$19 52.73,6.7 IN.1
R_OUT
  Top 0.406: OUT.1 25.4,2.29 30.48,2.29 32.38,4.19 35.56,4.19 36.12,4.75 U2.P$13
SWCLK  (via drill 0.5)
  Top 0.203: U4.109 27.55,47.3 v27.62,47.37
  Bottom 0.203: v27.62,47.37 27.62,52.45 28.89,53.72 33.02,53.72 SWD.2
SWDIO  (via drill 0.5)
  Top 0.203: U4.105 27.05,43.82 v26.04,44.83
  Bottom 0.203: 26.04,45.47 v26.04,44.83 26.04,49.91 26.67,50.55 26.67,52.45 SWD.4
SWO  (via drill 0.5)
  Top 0.203: U4.133 14.53,46.18 v15.24,45.47
  Bottom 0.203: SWD.6 23.81,55.31 17.14,55.31 14.61,52.77 14.61,46.1 v15.24,45.47
UART_RX  (via drill 0.5)
  Top 0.203: U4.136 13.03,45.77 v13.34,45.47
  Bottom 0.203: v13.34,45.47 13.34,53.09 UART.5
UART_TX  (via drill 0.5)
  Top 0.203: U4.137 12.52,45.92 v12.06,45.47
  Bottom 0.203: v12.06,45.47 11.43,45.47 10.79,46.1 10.79,53.09 UART.4
USB_DM  (via drill 0.5, 0.5 pad 0.5)
  Top 0.203: U4.103 32.6,42.82 34.29,44.51 v34.29,47.37 | v36.51,52.77 39.37,52.77 40.32,53.72 42.86,53.72 45.4,51.18 v48.26,51.18 R5.2
  Bottom 0.203: v36.51,52.77 35.56,51.82 35.56,48.64 v34.29,47.37 | v48.26,51.18 48.26,53.72 USB.3
USB_DP  (via drill 0.5, 0.5 pad 0.5)
  Top 0.203: U4.104 32.47,43.33 33.66,44.51 33.66,46.74 v33.02,47.37 | R4.2 v46.99,52.77 44.77,52.77 43.18,54.36 39.05,54.36 v38.42,53.72
  Bottom 0.203: v38.42,53.72 36.2,53.72 34.29,51.82 34.29,48.64 v33.02,47.37 | v46.99,52.77 USB.2
USB_ID  (via drill 0.5)
  Top 0.203: U4.102 32.73,42.32 35.24,44.83 v35.24,46.74 | USB.1 45.72,53.72 52.07,53.72 54.28,51.51 USB1.4
  Bottom 0.203: v35.24,46.74 35.88,47.37 38.1,47.37 38.73,48.01 38.73,52.77 40.01,54.04 43.5,54.04 USB.1
USB_VBUS  (via drill 0.5, 0.5 pad 0.5)
  Top 0.203: U4.101 32.88,41.83 36.2,45.15 v36.2,46.1 | v40.64,52.77 40.96,53.09 42.86,53.09 46.04,49.91 v51.44,49.91
  Top 0.406: 51.47,49.88 v51.44,49.91 51.78,49.56 USB1.1
  Bottom 0.203: v40.64,52.77 39.69,51.82 39.69,48.01 38.42,46.74 36.83,46.74 v36.2,46.1 | USB.4 51.44,54.36 v51.44,49.91
  Bottom 0.406: JP1.2 21.59,2.29 23.18,0.7 55.56,0.7 57.15,2.29 57.15,8.95 59.05,10.86 59.05,42.29 v51.44,49.91
VCAP1
  Top 0.305: U4.71 26.04,24.51 26.67,23.88 C20.2
VCAP2
  Top 0.305: U4.106 30.07,44.32 C21.1
VCC/2
  Top 0.406: U2.P$16 46.85,4.75 C309.1 48.05,2.2 C308.1
VDDA
  Top 0.305: C18.1 L3.1 6.35,24.51 5.71,25.15 5.71,28.96 6.1,29.34 U4.33 U4.32

### Text on the board
tPlace: PA4 | PA6 | PC4 | PB0 | PB2 | OWL Rev02 | Rebel Technology | PA3 | PA5 | PA7 | PC5 | PB1 | 5v | gnd | 3v3